# Altium schematic sheet Schem_Display_2021-08-04.schdoc
size 164 x 140 mm
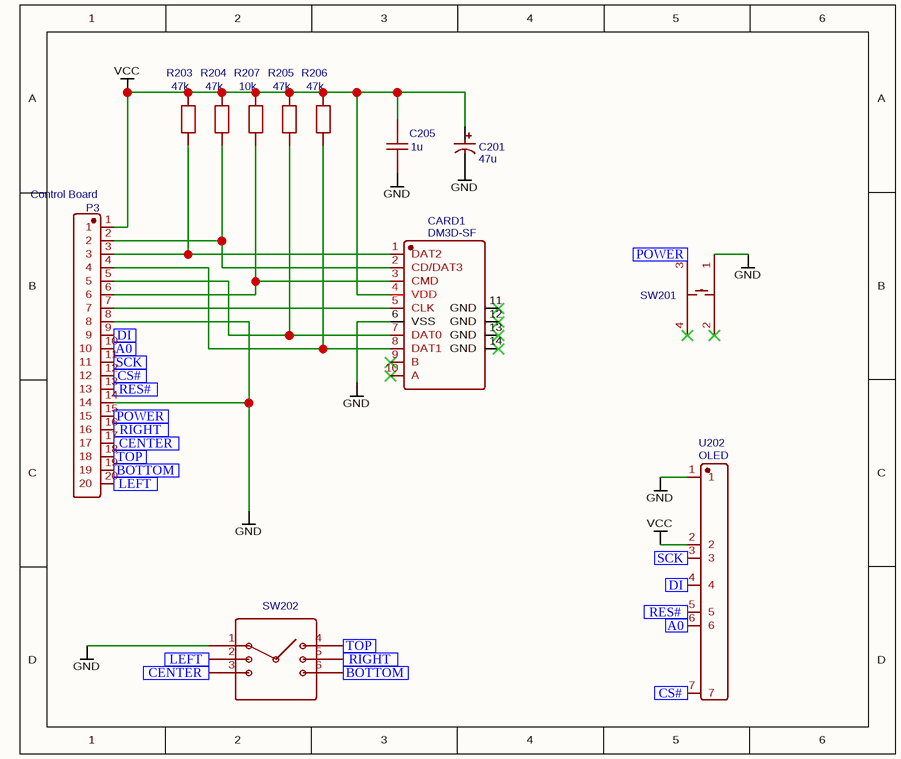
[diagram p0: Schem_Display_2021-08-04.schdoc]

## Parts
C201  47u  [CAP-TH_BD5.0-P2.00-D0.8-FD]
C205  1u  [RAD-0.1]
CARD1  DM3D-SF  [TF-SMD_DM3D-SF]
P3  Control Board  [HDR-TH_20P-P2.54-V]
R203  47k  [R_AXIAL-0.3]
R204  47k  [R_AXIAL-0.3]
R205  47k  [R_AXIAL-0.3]
R206  47k  [R_AXIAL-0.3]
R207  10k  [R_AXIAL-0.3]
SW201  K2-1839SP-C4SW-02  [KEY-TH_4P-L6.2-W6.2-P4.50-LS6.5]  (value not drawn)
SW202  TSX103G901-250  [SW-SMD_TSX103G901-250]  (value not drawn)
U202  OLED  [7P]

## Ports
A0 (in), BOTTOM (in), CENTER (in), CS# (in), DI (in), LEFT (in), POWER (in), RES# (in), RIGHT (in), SCK (in), TOP (in)

## Nets
GND: C201.2 C205.1 CARD1.6(VSS) P3.8 P3.14 SW201.1 SW202.1(COM) U202.1
VCC: C201.1 C205.2 CARD1.4(VDD) P3.1 R203.1 R204.1 R205.1 R206.1 R207.1 U202.2
A0: P3.10 U202.6 ; port A0
BOTTOM: P3.19 SW202.6(F3) ; port BOTTOM
CENTER: P3.17 SW202.3(F5) ; port CENTER
CS#: P3.12 U202.7 ; port CS#
DI: P3.9 U202.4 ; port DI
LEFT: P3.20 SW202.2(F2) ; port LEFT
POWER: P3.15 SW201.3 ; port POWER
RES#: P3.13 U202.5 ; port RES#
RIGHT: P3.16 SW202.5(F4) ; port RIGHT
SCK: P3.11 U202.3 ; port SCK
TOP: P3.18 SW202.4(F1) ; port TOP
NetCARD1_1: CARD1.1(DAT2) P3.3 R203.2
NetCARD1_2: CARD1.2(CD/DAT3) P3.2 R204.2
NetCARD1_3: CARD1.3(CMD) P3.6 R207.2
NetCARD1_5: CARD1.5(CLK) P3.7
NetCARD1_7: CARD1.7(DAT0) P3.5 R205.2
NetCARD1_8: CARD1.8(DAT1) P3.4 R206.2

Not connected (* = marked no-connect by the designer): CARD1 9(B)* 10(A)* 11(GND)* 12(GND)* 13(GND)* 14(GND)*; SW201 2* 4*

## Library data of the parts
C201 = 47u: BOM_Manufacturer: ValuePro; BOM_Manufacturer Part: 47uF 25V 5*11; nameAlias: Capacitance; BOM_Supplier: LCSC; BOM_Supplier Part: C43350; BOM_JLCPCB Part Class: Extended Part; spicePre: C; spiceSymbolName: 47uF 25V 5*11
C205 = 1u: nameAlias: Value(F); Contributor: LCEDA_Lib; spicePre: C; spiceSymbolName: C_RAD-0.1_US
CARD1 = DM3D-SF: BOM_Manufacturer: HRS(Hirose); Contributor: LCSC; BOM_Supplier: LCSC; BOM_Supplier Part: C719027; BOM_Manufacturer Part: DM3D-SF; BOM_JLCPCB Part Class: Extended Part; spicePre: C; spiceSymbolName: DM3D-SF
P3 = Control Board: BOM_Manufacturer: BOOMELE; BOM_Manufacturer Part: 2.54mm 1*20PHeader; BOM_Supplier: LCSC; BOM_Supplier Part: C50981; BOM_JLCPCB Part Class: Extended Part; spicePre: J; spiceSymbolName: Header-Male-2.54_1x20
R203-R206 = 47k: nameAlias: Value(Ω); Contributor: LCEDA_Lib; spicePre: R; spiceSymbolName: R_AXIAL-0.3_EU
R207 = 10k: nameAlias: Value(Ω); Contributor: LCEDA_Lib; spicePre: R; spiceSymbolName: R_AXIAL-0.3_EU
SW201 = K2-1839SP-C4SW-02: BOM_Manufacturer: Korean Hroparts Elec; Contributor: LCSC; BOM_Supplier: LCSC; BOM_Supplier Part: C164133; BOM_Manufacturer Part: K2-1839SP-C4SW-02; BOM_JLCPCB Part Class: Extended Part; spicePre: S; spiceSymbolName: K2-1839SP-C4SW-02
SW202 = TSX103G901-250: BOM_Manufacturer: BRIGHT(博瑞泰); Contributor: LCSC; BOM_Supplier: LCSC; BOM_Supplier Part: C722956; BOM_Manufacturer Part: TSX103G901-250; BOM_JLCPCB Part Class: Extended Part; spicePre: S; spiceSymbolName: TSX103G901-250
U202 = OLED: BOM_Manufacturer: BOOMELE; BOM_Manufacturer Part: Double row of needle2X7P 2.54mm; Contributor: xavierlin; BOM_Supplier: LCSC; BOM_Supplier Part: C71397; spicePre: 7; spiceSymbolName: 7P